# Altium schematic sheet Keo_truot_cua_tu_6_sensor_1_schematic.SchDoc
size A3
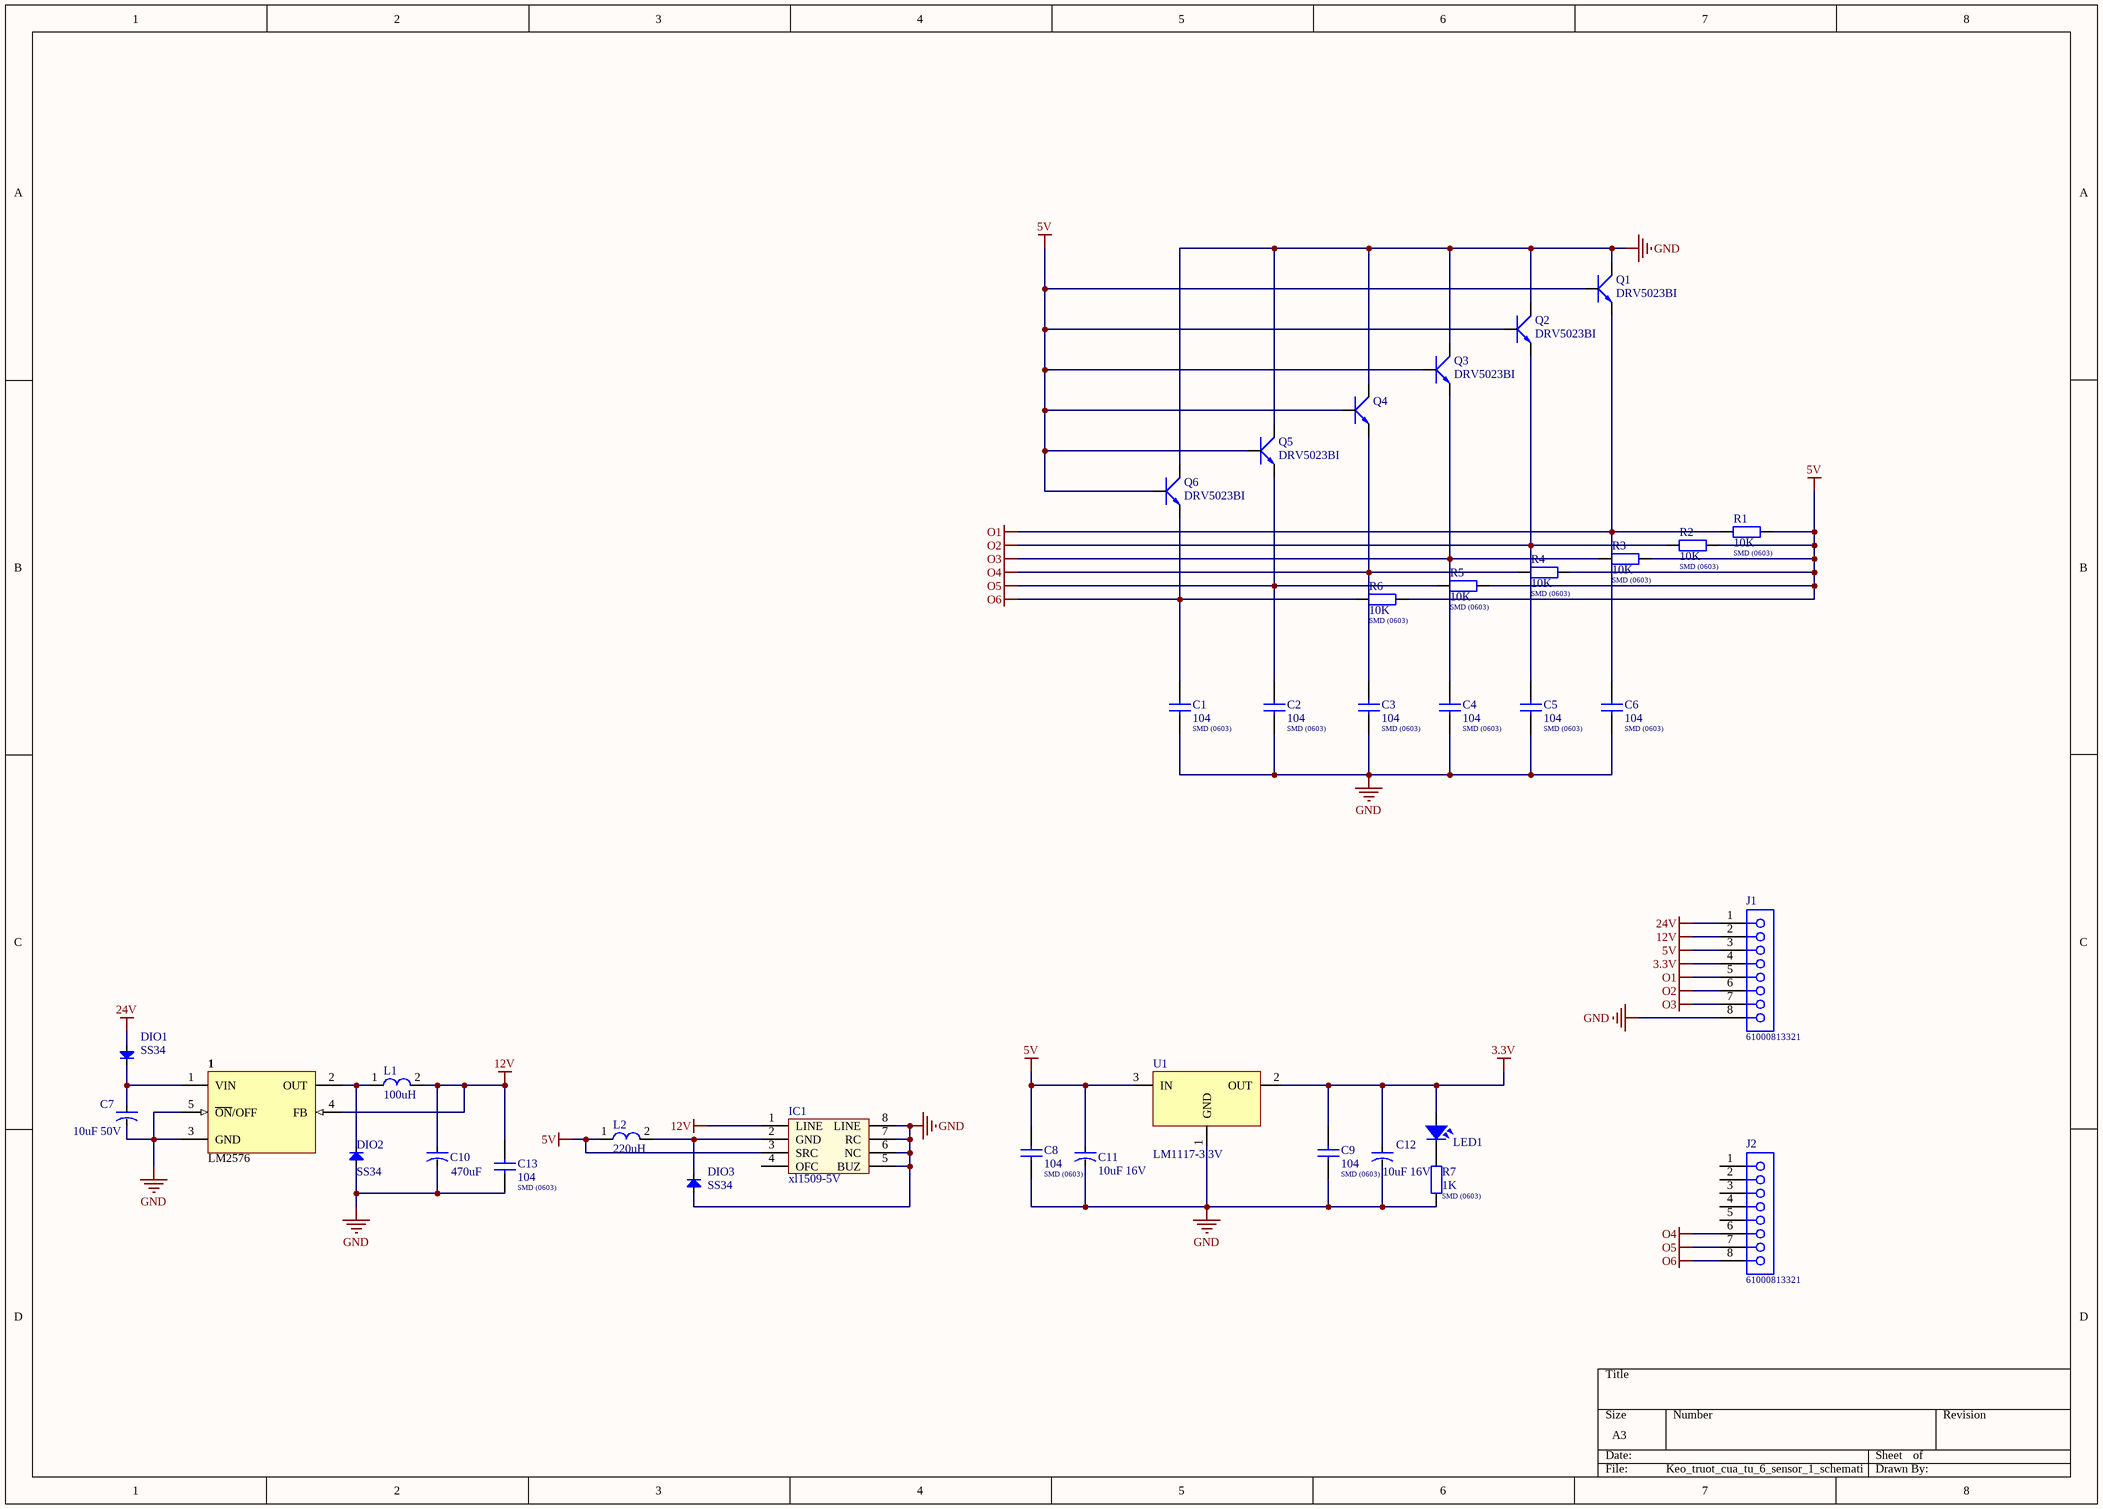
[diagram p0: Keo_truot_cua_tu_6_sensor_1_schematic.SchDoc]

## Parts
1  LM2576  [TO263]
C1  Valor: 104  Encapsulamento: SMD (0603)  [CAP_0603]  (hidden comment: 104 16V)
C2  Valor: 104  Encapsulamento: SMD (0603)  [CAP_0603]  (hidden comment: 104 16V)
C3  Valor: 104  Encapsulamento: SMD (0603)  [CAP_0603]  (hidden comment: 104 16V)
C4  Valor: 104  Encapsulamento: SMD (0603)  [CAP_0603]  (hidden comment: 104 16V)
C5  Valor: 104  Encapsulamento: SMD (0603)  [CAP_0603]  (hidden comment: 104 16V)
C6  Valor: 104  Encapsulamento: SMD (0603)  [CAP_0603]  (hidden comment: 104 16V)
C7  10uF 50V  [CAP-ALU-SMD-6.3x7.7x2.2]
C8  Valor: 104  Encapsulamento: SMD (0603)  [CAP_0603]  (hidden comment: 104 16V)
C9  Valor: 104  Encapsulamento: SMD (0603)  [CAP_0603]  (hidden comment: 104 16V)
C10  470uF  [CAP-ALU-SMD-6.3x7.7x2.2]
C11  10uF 16V  [CAP-ALU-SMD-4.5x5x1.4]
C12  10uF 16V  [CAP-ALU-SMD-4.5x5x1.4]
C13  Valor: 104  Encapsulamento: SMD (0603)  [CAP_0603]  (hidden comment: 104 16V)
DIO1  SS34  [DIO-SMD-106]
DIO2  SS34  [DIO-SMD-106]
DIO3  SS34  [DIO-SMD-106]
IC1  xl1509-5V  [SO-8]
J1  61000813321  [61000813321]
J2  61000813321  [61000813321]
L1  100uH  [L-SMD-M-12x10]
L2  220uH  [L-SMD-M-7.3x4.5]
LED1  LED  [LED-0805-Red]  (value not drawn)
Q1  DRV5023BI  [SOT23B]
Q2  DRV5023BI  [SOT23B]
Q3  DRV5023BI  [SOT23B]
Q4  DRV5023BI  [SOT23B]  (value not drawn)
Q5  DRV5023BI  [SOT23B]
Q6  DRV5023BI  [SOT23B]
R1  Encapsulamento: SMD (0603)  [RES_0603]  (hidden comment: 10K)
R2  Encapsulamento: SMD (0603)  [RES_0603]  (hidden comment: 10K)
R3  Encapsulamento: SMD (0603)  [RES_0603]  (hidden comment: 10K)
R4  Encapsulamento: SMD (0603)  [RES_0603]  (hidden comment: 10K)
R5  Encapsulamento: SMD (0603)  [RES_0603]  (hidden comment: 10K)
R6  Encapsulamento: SMD (0603)  [RES_0603]  (hidden comment: 10K)
R7  Encapsulamento: SMD (0603)  [RES_0603]  (hidden comment: 1K)
U1  LM1117-3.3V  [SOT223]

## Nets
3.3V: C9.2 C12.1 J1.4 LED1.1 U1.2(OUT)
5V: C8.2 C11.1 IC1.3(SRC) J1.3 L2.1 Q1.3(B) Q2.3(B) Q3.3(B) Q4.3(B) Q5.3(B) Q6.3(B) R1.2 R2.2 R3.2 R4.2 R5.2 R6.2 U1.3(IN)
12V: 1.4(FB) C10.1 C13.2 IC1.1(LINE) J1.2 L1.2
24V: DIO1.1(A) J1.1
GND: 1.3(GND) 1.5(~{ON}/OFF) C1.1 C2.1 C3.1 C4.1 C5.1 C6.1 C7.2 C8.1 C9.1 C10.2 C11.2 C12.2 C13.1 DIO2.1(A) DIO3.1(A) IC1.5(BUZ) IC1.6(NC) IC1.7(RC) IC1.8(LINE) J1.8 Q1.2(C) Q2.2(C) Q3.2(C) Q4.2(C) Q5.2(C) Q6.2(C) R7.1 U1.1(GND)
O1: C6.2 J1.5 Q1.1(E) R1.1
O2: C5.2 J1.6 Q2.1(E) R2.1
O3: C4.2 J1.7 Q3.1(E) R3.1
O4: C3.2 J2.6 Q4.1(E) R4.1
O5: C2.2 J2.7 Q5.1(E) R5.1
O6: C1.2 J2.8 Q6.1(E) R6.1
Net1_1: 1.1(VIN) C7.1 DIO1.2(K)
Net1_2: 1.2(OUT) DIO2.2(K) L1.1
NetDIO3_2: DIO3.2(K) IC1.2(GND) L2.2
NetLED1_2: LED1.2 R7.2

Not connected (* = marked no-connect by the designer): IC1 4(OFC); J2 1 2 3 4 5

## Library data of the parts
1 = LM2576: Max Input Voltage: 12 V; Max Output Current: 3 (6.0 peak) A; Max Output Voltage: mV; Category: IC-Power; Min Input Voltage: mV; Min Output Voltage: mV; Mounting Technology: Surface Mount; Status: Unreleased; Supply Voltage: mV; Temperature Range: -40 to +125 degC
C1-C6 C8 C9 C13 = Capacitor SMD: Descrição: Capacitor SMD; Marca: *; Modelo: *; Observação: *
C7 C10-C12 = CN-ALU-SMD: Polarized Capacitor (Axial); Published: 8-Jun-2000; LatestRevisionDate: 17-Jul-2002; LatestRevisionNote: Re-released for DXP Platform.; PackageReference: POLAR0.8; Publisher: Altium Limited
DIO1-DIO3 = Diode SMD: Default Diode; Code - JEDEC: DO-214-AB; Value: 1N5007; Published: 8-Jun-2000; Revision: July-2002: Re-released for DXP Platform.; Publisher: Altium Limited
IC1 = LS1240A: Electronic Two-Tone Ringer
J1 J2 = 61000813321: SMT Vertical Socket Header WR-PHD, Pitch 2.54 mm, Single Row, 8 pins; Pin Number: 8; Pitch: 2.54 mm; Gender: Female; Rated Current: 3 A; Working Voltage: 250 VAC; Withstanding Voltage: 500 VAC; Contact Resistance: 20 mOhm; ComponentLink1Description: Manufacturer; ComponentLink1URL: http://www.we-online.de; ComponentLink2Description: Datasheet; ComponentLink2URL: https://katalog.we-online.de/em/datasheet/6100xx13321.pdf; Part Number: 61000813321; Published Date: August 2018; Publisher: Wurth Elektronik; Operating Temperature: -40 to 125 degC; Mounting Technology: SMT; Packaging: Tube; Row Number: Single; Orientation: Vertical
L1 L2 = L-SMD-1: partNo: 78477010; Manufacturer: Wurth Elektronik; Inductance: 1.0 μH; ComponentLink1Description: Manufacturer; ComponentLink1URL: http://www.we-online.de; Created by: Baojun Chen; Created Date: Nov.2015; ComponentLink2Description: Datasheet; ComponentLink2URL: http://katalog.we-online.de/pbs/datasheet/78477010.pdf
LED1 = LED SMD: Value: LED 3 - 5 ly 2 Colour
Q1-Q6 = C1815: hall sensor; Value: C1815
R1-R7 = Resistor SMD: Descrição: Resistor SMD 5%; Marca: *; Modelo: *; Observação: *
  R1-R6: Valor: 10K
  R7: Valor: 1K
U1 = LM1117: 800mA Low-Dropout Linear Regulator; Creator: Nguyen Ba Bien; Website: http://group3i.net